# EAGLE design Project2 (EAGLE 9.6.2)
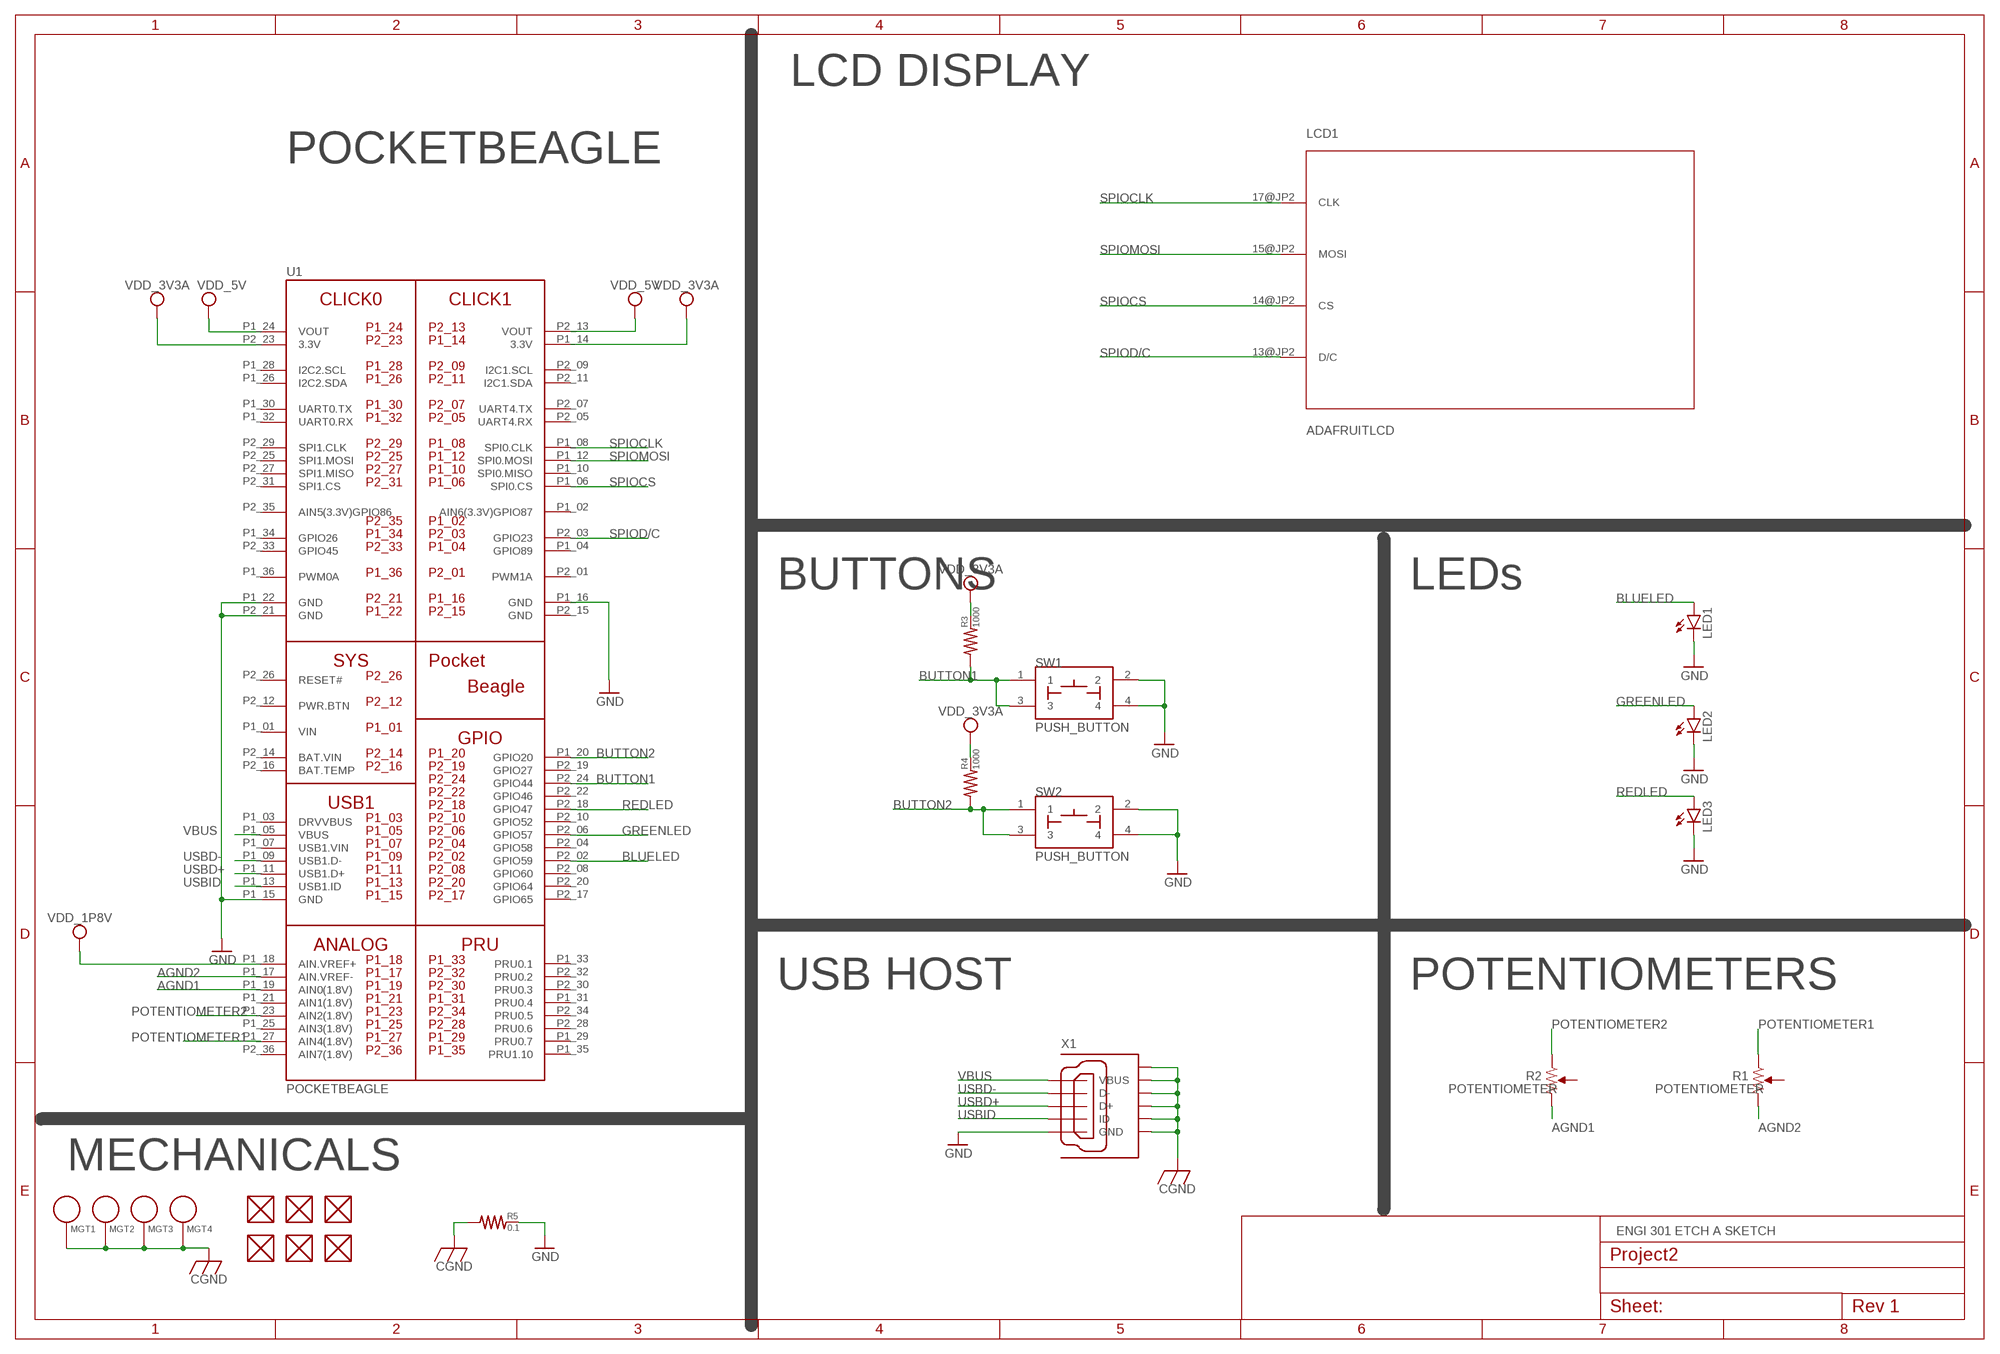
[diagram p0: schematic, sheet 1]

## Parts
FUD1  FIDUCIAL  [FIDUCIAL_40MIL]
FUD2  FIDUCIAL  [FIDUCIAL_40MIL]
FUD3  FIDUCIAL  [FIDUCIAL_40MIL]
FUD4  FIDUCIAL  [FIDUCIAL_40MIL]
FUD5  FIDUCIAL  [FIDUCIAL_40MIL]
FUD6  FIDUCIAL  [FIDUCIAL_40MIL]
LCD1  ADAFRUITLCD  [TFTBREAKOUT]
LED1  LED-(INCH)-0603  [0603-LED]
LED2  LED-(INCH)-0603  [0603-LED]
LED3  LED-(INCH)-0603  [0603-LED]
MGT1  MOUNTING_HOLE  [MOUNTING_HOLE]
MGT2  MOUNTING_HOLE  [MOUNTING_HOLE]
MGT3  MOUNTING_HOLE  [MOUNTING_HOLE]
MGT4  MOUNTING_HOLE  [MOUNTING_HOLE]
R1  POTENTIOMETER  [POT-PO90S]
R2  POTENTIOMETER  [POT-PO90S]
R3  1000  RESISTOR-(INCH)-0402  [0402]
R4  1000  RESISTOR-(INCH)-0402  [0402]
R5  0.1  RESISTOR-(INCH)-0805  [0805]
SW1  PUSH_BUTTON  [BUTTON_12.5MM]
SW2  PUSH_BUTTON  [BUTTON_12.5MM]
U1  POCKETBEAGLE  [POCKETBEAGLE]
X1  10118192-0001LF  [10118192-0001LF(MICRO-USB-B-AMPHENOL-FCI)]

## Nets
AGND1: R2.CW U1.P1_19(AIN0(1.8V))
AGND2: R1.CW U1.P1_17(AIN.VREF-)
BLUELED: LED1.A U1.P2_02(GPIO59)
BUTTON1: R3.1 SW1.1 SW1.3 U1.P2_24(GPIO44)
BUTTON2: R4.1 SW2.1 SW2.3 U1.P1_20(GPIO20)
CGND: MGT1.P$1 MGT2.P$1 MGT3.P$1 MGT4.P$1 R5.1 X1.CGND1(SGND1) X1.CGND2(SGND2) X1.CGND3(SGND3) X1.CGND4(SGND4) X1.CGND5(SGND5) X1.CGND6(SGND6)
GND: LED1.K LED2.K LED3.K R5.2 SW1.2 SW1.4 SW2.2 SW2.4 U1.P1_15(GND) U1.P1_16(GND) U1.P1_22(GND) U1.P2_21(GND) X1.GND
GREENLED: LED2.A U1.P2_06(GPIO57)
POTENTIOMETER1: R1.CCW U1.P1_27(AIN4(1.8V))
POTENTIOMETER2: R2.CCW U1.P1_23(AIN2(1.8V))
REDLED: LED3.A U1.P2_18(GPIO47)
SPIOCLK: LCD1.17@JP2(CLK) U1.P1_08(SPI0.CLK)
SPIOCS: LCD1.14@JP2(CS) U1.P1_06(SPI0.CS)
SPIOD/C: LCD1.13@JP2(D/C) U1.P2_03(GPIO23)
SPIOMOSI: LCD1.15@JP2(MOSI) U1.P1_12(SPI0.MOSI)
USBD+: U1.P1_11(USB1.D+) X1.D+
USBD-: U1.P1_09(USB1.D-) X1.D-
USBID: U1.P1_13(USB1.ID) X1.ID
VBUS: U1.P1_05(VBUS) X1.VBUS
VDD_1P8V: U1.P1_18(AIN.VREF+)
VDD_3V3A: R3.2 R4.2 U1.P1_14(3.3V) U1.P2_23(3.3V)
VDD_5V: U1.P1_24(VOUT) U1.P2_13(VOUT)
Unconnected: FUD1.P$1 FUD2.P$1 FUD3.P$1 FUD4.P$1 FUD5.P$1 FUD6.P$1 R1.S R2.S U1.P1_02(AIN6(3.3V)GPIO87) U1.P1_03(DRVVBUS) U1.P1_04(GPIO89) U1.P1_07(USB1.VIN) U1.P1_10(SPI0.MISO) U1.P1_21(AIN1(1.8V)) U1.P1_25(AIN3(1.8V)) U1.P1_26(I2C2.SDA) U1.P1_28(I2C2.SCL) U1.P1_29(PRU0.7) U1.P1_30(UART0.TX) U1.P1_31(PRU0.4) U1.P1_32(UART0.RX) U1.P1_33(PRU0.1) U1.P1_34(GPIO26) U1.P1_35(PRU1.10) U1.P1_36(PWM0A) U1.P2_01(PWM1A) U1.P2_04(GPIO58) U1.P2_05(UART4.RX) U1.P2_07(UART4.TX) U1.P2_08(GPIO60) U1.P2_09(I2C1.SCL) U1.P2_10(GPIO52) U1.P2_11(I2C1.SDA) U1.P2_12(PWR.BTN) U1.P2_16(BAT.TEMP) U1.P2_17(GPIO65) U1.P2_19(GPIO27) U1.P2_20(GPIO64) U1.P2_22(GPIO46) U1.P2_25(SPI1.MOSI) U1.P2_26(RESET#) U1.P2_27(SPI1.MISO) U1.P2_28(PRU0.6) U1.P2_29(SPI1.CLK) U1.P2_30(PRU0.3) U1.P2_31(SPI1.CS) U1.P2_32(PRU0.2) U1.P2_33(GPIO45) U1.P2_34(PRU0.5) U1.P2_35(AIN5(3.3V)GPIO86) U1.P2_36(AIN7(1.8V))

## Notes on the sheet
- LCD DISPLAY
- POCKETBEAGLE
- BUTTONS | LEDs
- USB HOST | POTENTIOMETERS
- MECHANICALS
- ENGI 301 ETCH A SKETCH

## Power pins joined to a net without a drawn wire
BAT.VIN: U1.P2_14(BAT.VIN)
GND: U1.P2_15(GND)
VIN: U1.P1_01(VIN)

## Library data of the parts
FUD1-FUD6 = Project2:FIDUCIAL
LCD1 = Project2:ADAFRUITLCD: ILI9341 ADAFRUIT LCD DISPLAY
LED1-LED3 = Project2:LED-(INCH)-: Basic SMD LEDs
MGT1-MGT4 = Project2:MOUNTING_HOLE: Chassis Mounting Hole w/GND connection ability
R1 R2 = Project2:POTENTIOMETER: Potentiometer - Examples: P090S-14T20BR10K (987-1277-ND)
R3-R5 = Project2:RESISTOR-(INCH)-: Basic SMD Resistors
SW1 SW2 = Project2:PUSH_BUTTON
U1 = Project2:POCKETBEAGLE
X1 = Project2:10118192-0001LF: Amphenol FCI Micro USB Type B Complete Surface Mount (SMT) no guide holes

## Board
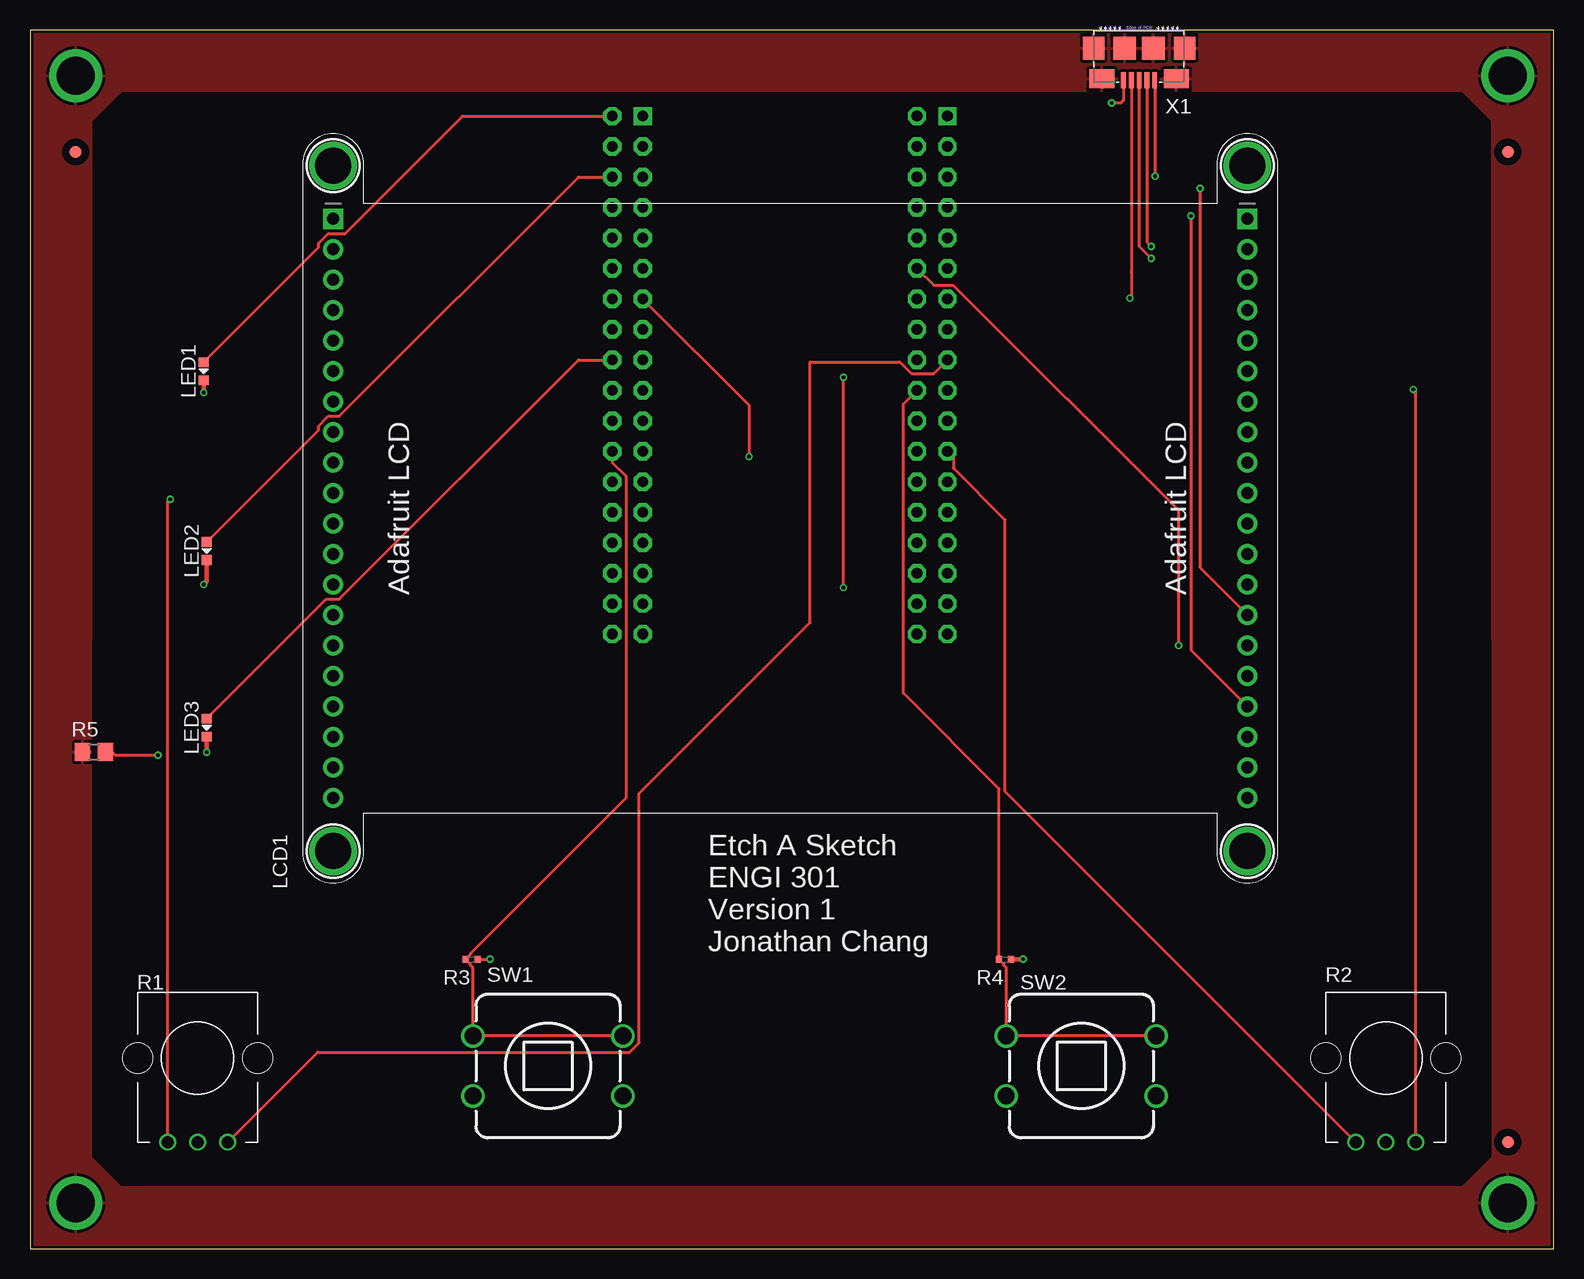
[diagram p1: board, top side]
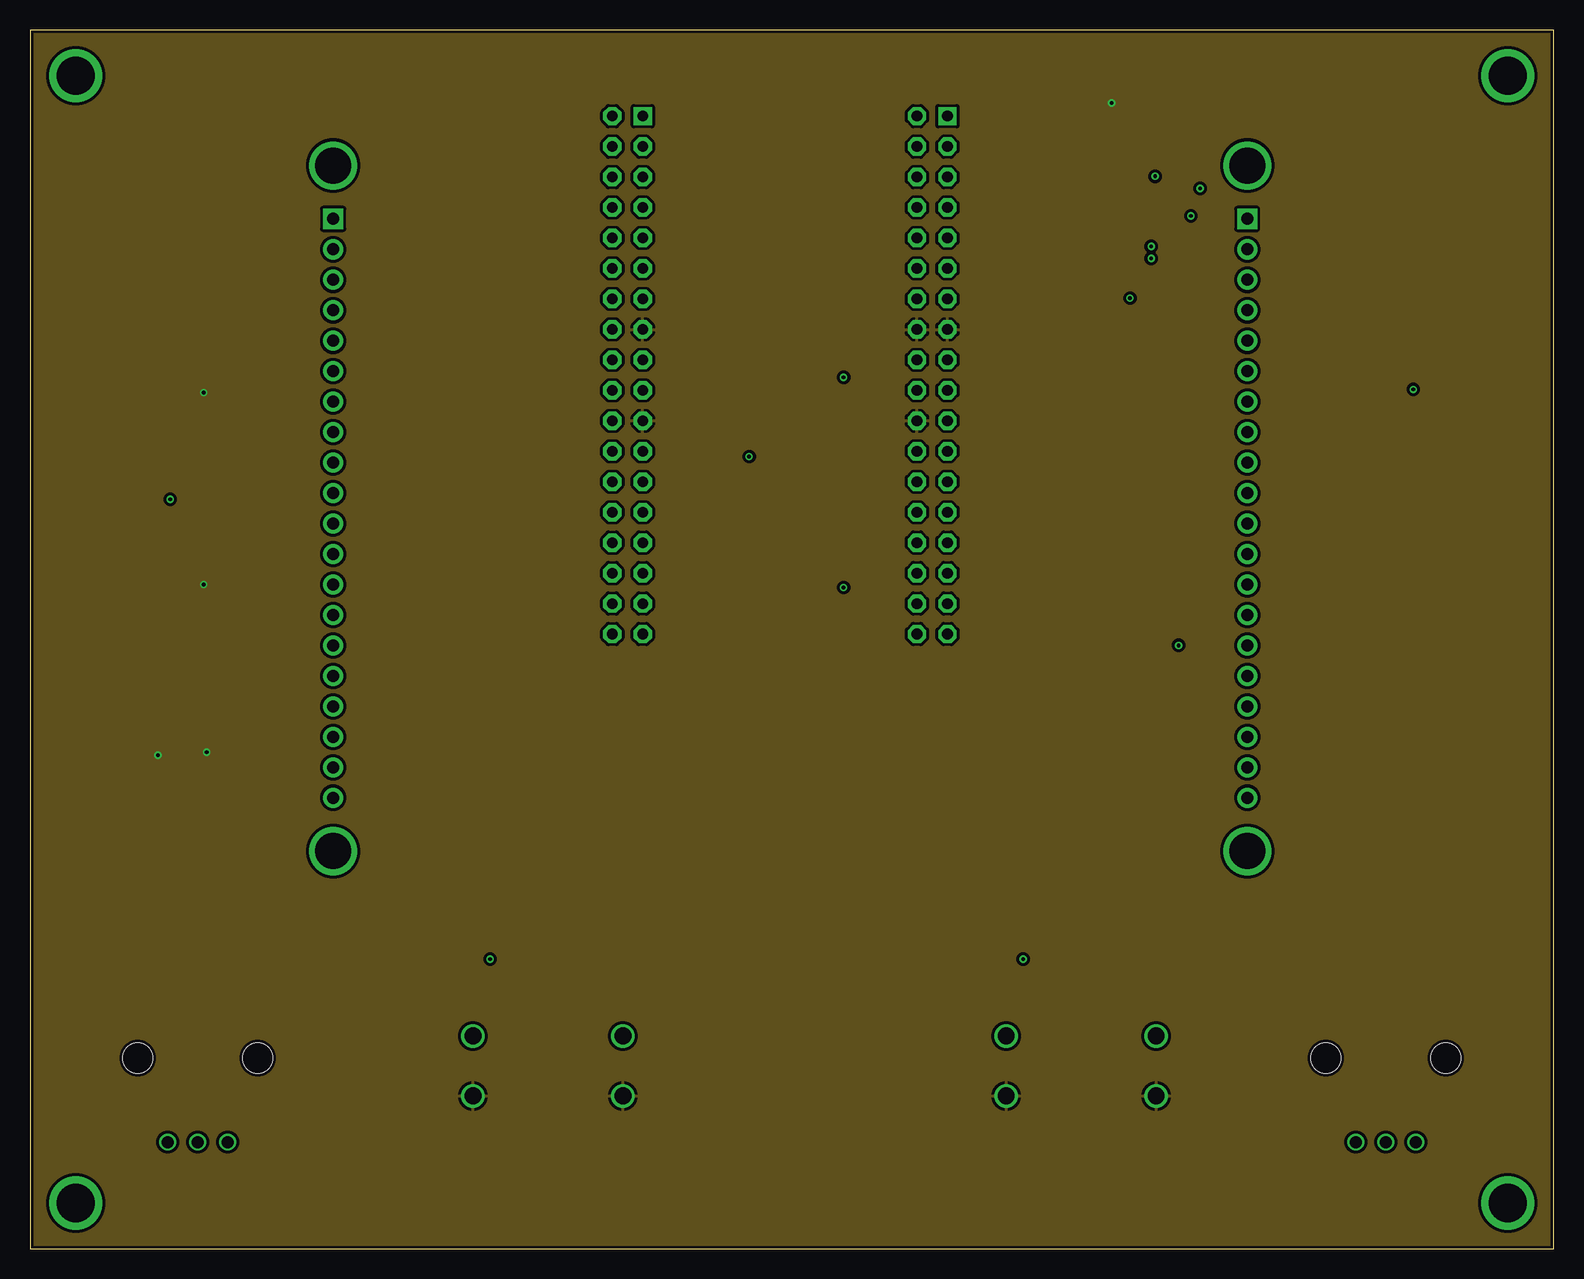
[diagram p2: board, inner layer Route2]
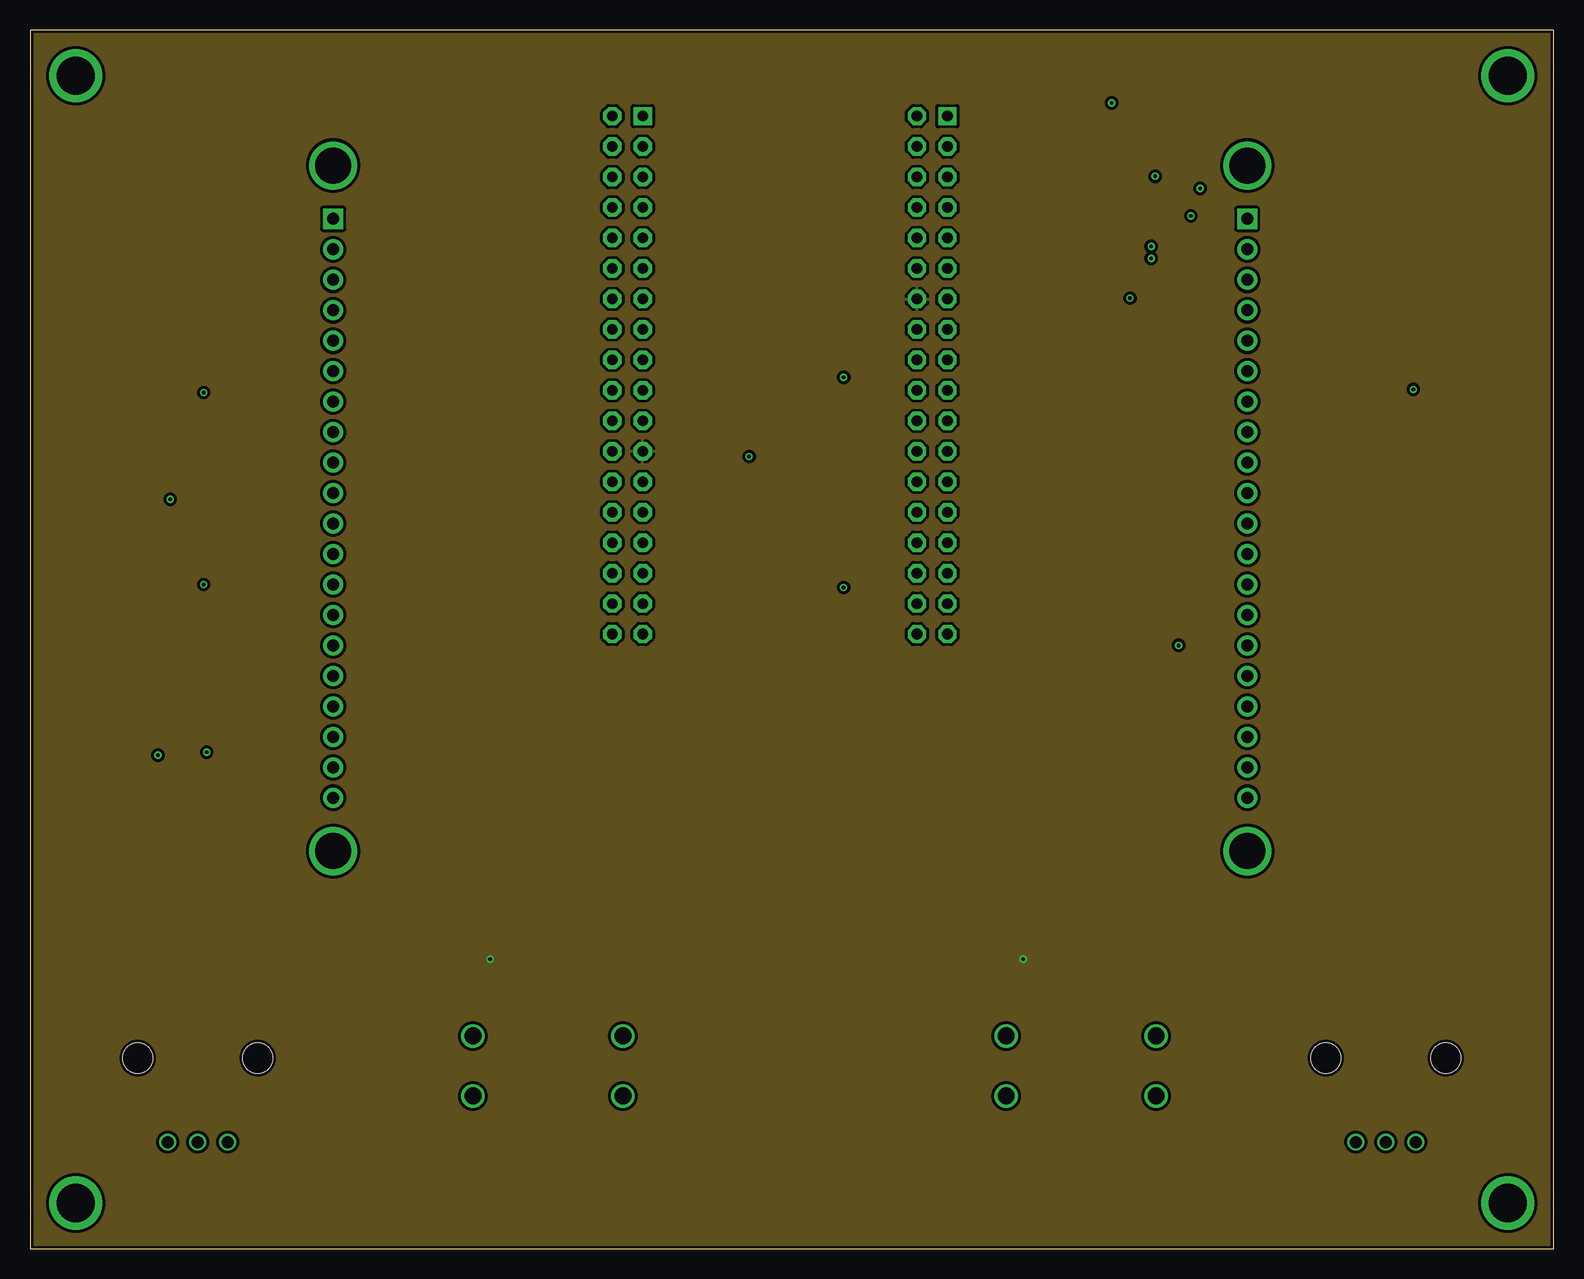
[diagram p3: board, inner layer Route15]
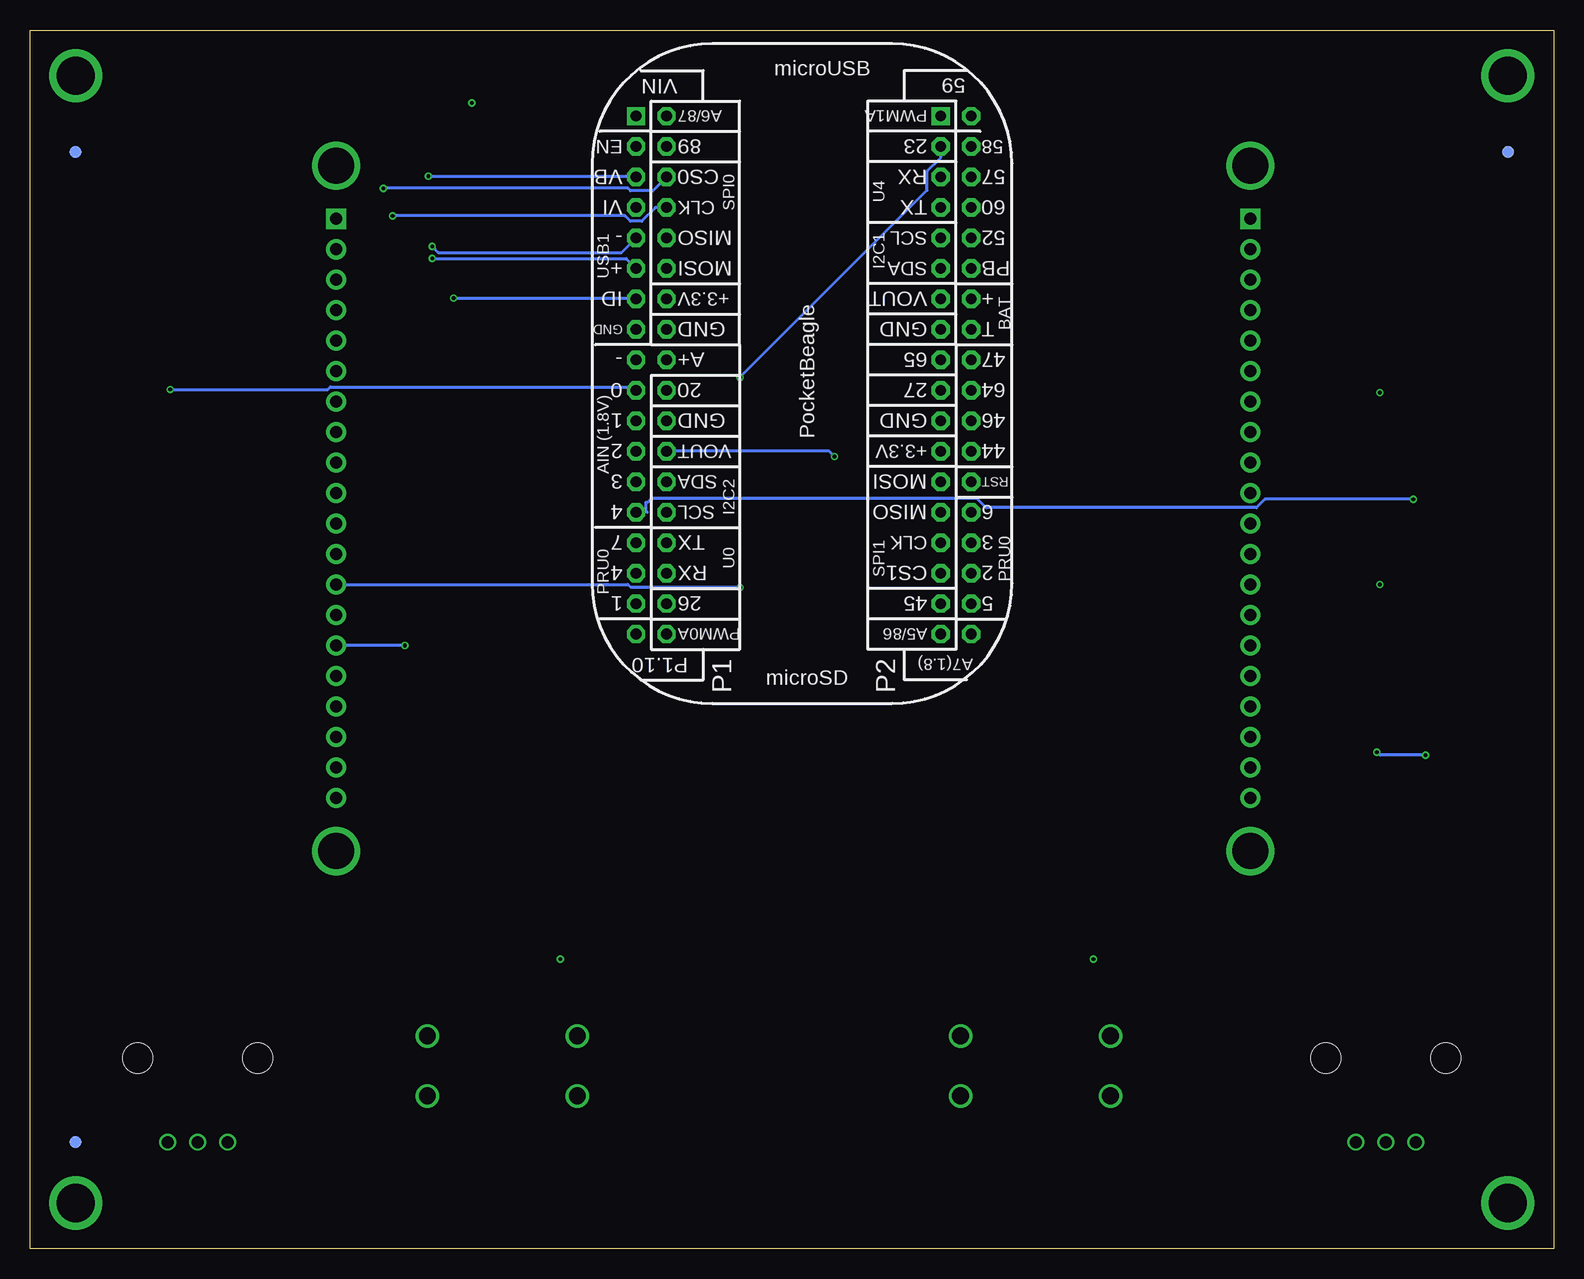
[diagram p4: board, bottom side, seen from below]

Size 127 x 101.6 mm. Coordinates in mm from the lower left corner, seen from the top.
Outline: 0,0 127,0 127,101.6 0,101.6 0,0
Copper layers (1*2*15*16): Top 0.035mm / dielectric 0.23mm / Route2 0.035mm / dielectric 0.93mm / Route15 0.035mm / dielectric 0.23mm / Bottom 0.035mm
Design rules "ENGI301_4lyr": minimum track width 10mil, minimum drill 12mil, track to track 10mil, track to pad 10mil, pad to pad 10mil, via to via 10mil, smd to smd 10mil, copper to edge 10mil, drill to drill 12mil, minimum pad ring 6mil, minimum via ring 6mil, stop-mask expansion 3mil, vias tented up to drill 25mil, thermal gap 10mil

### Footprints (pad centres in the part's own frame; a part is rotated, then mirrored left to right if it is on the bottom)
FIDUCIAL_40MIL = smd 1.016 x 1.016: P$1 0,0
TFTBREAKOUT = drill 1 pad 1.676 square: 1@JP1 24.13,38.1; 1@JP2 24.13,-38.1 | drill 1 pad 1.676: 2@JP1 21.59,38.1; 2@JP2 21.59,-38.1; 3@JP1 19.05,38.1; 3@JP2 19.05,-38.1; 4@JP1 16.51,38.1; 4@JP2 16.51,-38.1; 5@JP1 13.97,38.1; 5@JP2 13.97,-38.1; 6@JP1 11.43,38.1; 6@JP2 11.43,-38.1; 7@JP1 8.89,38.1; 7@JP2 8.89,-38.1; 8@JP1 6.35,38.1; 8@JP2 6.35,-38.1; 9@JP1 3.81,38.1; 9@JP2 3.81,-38.1; 10@JP1 1.27,38.1; 10@JP2 1.27,-38.1; 11@JP1 -1.27,38.1; 11@JP2 -1.27,-38.1; 12@JP1 -3.81,38.1; 12@JP2 -3.81,-38.1; 13@JP1 -6.35,38.1; 13@JP2 -6.35,-38.1; 14@JP1 -8.89,38.1; 14@JP2 -8.89,-38.1; 15@JP1 -11.43,38.1; 15@JP2 -11.43,-38.1; 16@JP1 -13.97,38.1; 16@JP2 -13.97,-38.1; 17@JP1 -16.51,38.1; 17@JP2 -16.51,-38.1; 18@JP1 -19.05,38.1; 18@JP2 -19.05,-38.1; 19@JP1 -21.59,38.1; 19@JP2 -21.59,-38.1; 20@JP1 -24.13,38.1; 20@JP2 -24.13,-38.1 | drill 3 pad 3.6: P$1@U$7 -28.575,-38.1; P$1@U$15 28.575,-38.1; P$1@U$16 -28.575,38.1; P$1@U$17 28.575,38.1
0603-LED = smd 0.8 x 0.8: A 0,0.75; K 0,-0.75
MOUNTING_HOLE = drill 3.175 pad 4.445: P$1 0,0
POT-PO90S = drill 1: CCW -2.5,0; CW 2.5,0; S 0,0 | hole 2.5: -5,7; 5,7
0402 = smd 0.5 x 0.6: 1 -0.5,0; 2 0.5,0
0805 = smd 1.3 x 1.5: 1 -0.95,0; 2 0.95,0
BUTTON_12.5MM = drill 1.4: 1 -6.25,2.5; 2 -6.25,-2.5; 3 6.25,2.5; 4 6.25,-2.5
POCKETBEAGLE = drill 0.889 pad 1.524 square: P1_01 5.91,3.53; P2_01 5.91,28.93 | drill 0.889 pad 1.524 octagon: P1_02 5.91,6.07; P1_03 8.45,3.53; P1_04 8.45,6.07; P1_05 10.99,3.53; P1_06 10.99,6.07; P1_07 13.53,3.53; P1_08 13.53,6.07; P1_09 16.07,3.53; P1_10 16.07,6.07; P1_11 18.61,3.53; P1_12 18.61,6.07; P1_13 21.15,3.53; P1_14 21.15,6.07; P1_15 23.69,3.53; P1_16 23.69,6.07; P1_17 26.23,3.53; P1_18 26.23,6.07; P1_19 28.77,3.53; P1_20 28.77,6.07; P1_21 31.31,3.53; P1_22 31.31,6.07; P1_23 33.85,3.53; P1_24 33.85,6.07; P1_25 36.39,3.53; P1_26 36.39,6.07; P1_27 38.93,3.53; P1_28 38.93,6.07; P1_29 41.47,3.53; P1_30 41.47,6.07; P1_31 44.01,3.53; P1_32 44.01,6.07; P1_33 46.55,3.53; P1_34 46.55,6.07; P1_35 49.09,3.53; P1_36 49.09,6.07; P2_02 5.91,31.47; P2_03 8.45,28.93; P2_04 8.45,31.47; P2_05 10.99,28.93; P2_06 10.99,31.47; P2_07 13.53,28.93; P2_08 13.53,31.47; P2_09 16.07,28.93; P2_10 16.07,31.47; P2_11 18.61,28.93; P2_12 18.61,31.47; P2_13 21.15,28.93; P2_14 21.15,31.47; P2_15 23.69,28.93; P2_16 23.69,31.47; P2_17 26.23,28.93; P2_18 26.23,31.47; P2_19 28.77,28.93; P2_20 28.77,31.47; P2_21 31.31,28.93; P2_22 31.31,31.47; P2_23 33.85,28.93; P2_24 33.85,31.47; P2_25 36.39,28.93; P2_26 36.39,31.47; P2_27 38.93,28.93; P2_28 38.93,31.47; P2_29 41.47,28.93; P2_30 41.47,31.47; P2_31 44.01,28.93; P2_32 44.01,31.47; P2_33 46.55,28.93; P2_34 46.55,31.47; P2_35 49.09,28.93; P2_36 49.09,31.47
10118192-0001LF(MICRO-USB-B-AMPHENOL-FCI) = smd 1.8 x 1.9: CGND1 -3.8,0; CGND4 3.8,0 | smd 1.9 x 1.9: CGND2 -1.2,0; CGND3 1.2,0 | smd 2.1 x 1.6: CGND5 3.1,2.55; CGND6 -3.1,2.55 | smd 0.4 x 1.35: D+ 0,2.675; D- -0.65,2.675; GND 1.3,2.675; ID 0.65,2.675; VBUS -1.3,2.675

### Placement (x,y rotation side)
FUD1  3.81,91.44 0 top
FUD2  123.19,91.44 0 top
FUD3  3.81,91.44 180 bottom
FUD4  123.19,91.44 0 bottom
FUD5  123.19,8.89 0 bottom
FUD6  123.19,8.89 0 top
LCD1  63.37,61.72 90 top
LED1  14.48,73.15 0 top
LED2  14.73,58.17 0 top
LED3  14.73,43.43 0 top
MGT1  3.81,97.79 0 top
MGT2  3.81,3.81 0 top
MGT3  123.19,3.81 0 top
MGT4  123.19,97.79 0 top
R1  13.97,8.89 0 top
R2  113.03,8.89 0 top
R3  36.83,24.13 0 top
R4  81.28,24.13 0 top
R5  5.33,41.4 0 top
SW1  43.18,15.24 0 top
SW2  87.63,15.24 0 top
U1  80.01,100.33 270 bottom
X1  92.46,100.08 180 top

### Tracks (layer width: path | path; a pad name or v marks a point on that pad's centre or on a via)
AGND1  (via drill 0.3 pad 0.61)
  Top 0.254: R2.CW 115.53,71.41 v115.32,71.63
  Bottom 0.254: v115.32,71.63 102.18,71.63 101.98,71.83 76.75,71.83 U1.P1_19
AGND2
  Top 0.254: R1.CW 23.96,16.38 49.99,16.38 50.79,17.18 50.79,37.96 65.02,52.19 65.02,73.91 72.51,73.91 73.47,72.96 75.34,72.96 U1.P1_17
BLUELED
  Top 0.254: LED1.A 24.05,83.48 24.05,83.82 24.87,84.63 26.27,84.63 36.06,94.42 U1.P2_02
BUTTON1
  Top 0.254: U1.P2_24 48.54,65.56 49.68,64.41 49.68,37.57 36.7,24.59 36.7,24.5 R3.1 36.7,23.76 36.7,23.67 36.93,23.44 SW1.1 SW1.3
BUTTON2
  Top 0.254: SW2.3 SW2.1 81.38,23.44 81.15,23.67 81.15,23.76 R4.1 80.78,38.35 72.8,46.33 72.8,70.42 U1.P1_20
CGND
  pour Top: -2.54,50.8 -2.54,-2.54 129.54,-2.54 129.54,50.8 121.92,50.8 121.92,7.62 119.38,5.08 7.62,5.08 5.08,7.62 5.08,50.8
  pour Top: -2.54,50.8 -2.54,104.14 129.54,104.14 129.54,50.8 121.92,50.8 121.92,93.98 119.38,96.52 7.62,96.52 5.08,93.98 5.08,50.8
GND  (via drill 0.3 pad 0.61)
  Top 0.254: 14.73,55.63 v14.48,55.37 | R5.2 6.86,41.4 7.11,41.15 v10.67,41.15 | v90.17,95.5 90.93,95.5 91.16,95.73 X1.GND
  Top 0.381: LED2.K 14.73,55.63 | LED3.K v14.73,41.4 | LED1.K v14.48,71.37
  Bottom 0.254: v10.67,41.15 14.48,41.15 v14.73,41.4
  pour Route2: -5.08,106.68 132.08,106.68 132.08,-5.08 -5.08,-5.08
GREENLED
  Top 0.254: LED2.A 24.05,68.24 24.05,68.58 24.87,69.39 25.78,69.39 45.73,89.34 U1.P2_06
POTENTIOMETER1  (via drill 0.3 pad 0.61)
  Top 0.254: R1.CCW 11.47,62.27 v11.68,62.48
  Bottom 0.254: U1.P1_27 75.56,61.4 75.67,61.52 75.67,62.21 75.52,62.21 75.18,62.54 48.07,62.54 47.3,61.77 24.77,61.77 24.06,62.48 v11.68,62.48
POTENTIOMETER2
  Top 0.254: R2.CCW 81.29,38.13 81.29,60.75 76.96,65.07 76.96,66.55 76.55,66.55 U1.P1_23
REDLED
  Top 0.254: LED3.A 24.7,54.15 25.78,54.15 45.73,74.1 U1.P2_18
SPIOCLK  (via drill 0.3 pad 0.61)
  Top 0.254: v96.77,86.11 96.77,49.91 LCD1.17@JP2
  Bottom 0.254: U1.P1_08 74.86,86.8 76.01,85.66 76.95,85.66 77.4,86.11 v96.77,86.11
SPIOCS  (via drill 0.3 pad 0.61)
  Top 0.254: v97.54,88.39 97.54,56.77 LCD1.14@JP2
  Bottom 0.254: v97.54,88.39 77.15,88.39 76.95,88.2 75.08,88.2 U1.P1_06
SPIOD/C  (via drill 0.3 pad 0.61)
  Top 0.254: v67.82,55.12 v67.82,72.64
  Bottom 0.254: LCD1.13@JP2 77.15,55.37 76.95,55.18 67.88,55.18 v67.82,55.12 | v67.82,72.64 52.22,88.24 52.22,89.81 51.08,90.96 U1.P2_03
SPIOMOSI  (via drill 0.3 pad 0.61)
  Top 0.254: U1.P1_12 75.34,80.32 76.95,80.32 95.76,61.52 v95.76,50.29
  Bottom 0.254: v95.76,50.29 LCD1.15@JP2
USBD+  (via drill 0.3 pad 0.61)
  Top 0.254: X1.D+ 92.46,83.57 v93.47,82.55
  Bottom 0.254: v93.47,82.55 77.31,82.55 U1.P1_11
USBD-  (via drill 0.3 pad 0.61)
  Top 0.254: X1.D- 93.11,83.93 v93.47,83.57
  Bottom 0.254: v93.47,83.57 92.96,83.06 77.68,83.06 U1.P1_09
USBID  (via drill 0.3 pad 0.61)
  Top 0.254: X1.ID 91.81,81.53 91.81,81.39 91.81,79.36 v91.69,79.25
  Bottom 0.254: v91.69,79.25 76.55,79.25 U1.P1_13
VBUS  (via drill 0.3 pad 0.61)
  Top 0.254: X1.VBUS 93.76,89.44 93.73,89.41 v93.79,89.41
  Bottom 0.254: v93.79,89.41 76.55,89.41 U1.P1_05
VDD_3V3A  (via drill 0.3 pad 0.61)
  Top 0.254: R3.2 v38.35,24.13
  Top 0.381: R4.2 v82.8,24.13
  pour Route15: -7.62,109.22 134.62,109.22 134.62,-7.62 -7.62,-7.62
VDD_5V  (via drill 0.3 pad 0.61)
  Top 0.254: U1.P2_13 59.94,70.32 v59.94,66.04
  Bottom 0.254: v59.94,66.04 60.38,66.48 U1.P1_24

### Text on the board
tPlace: Etch A Sketch / ENGI 301 / Version 1 / Jonathan Chang